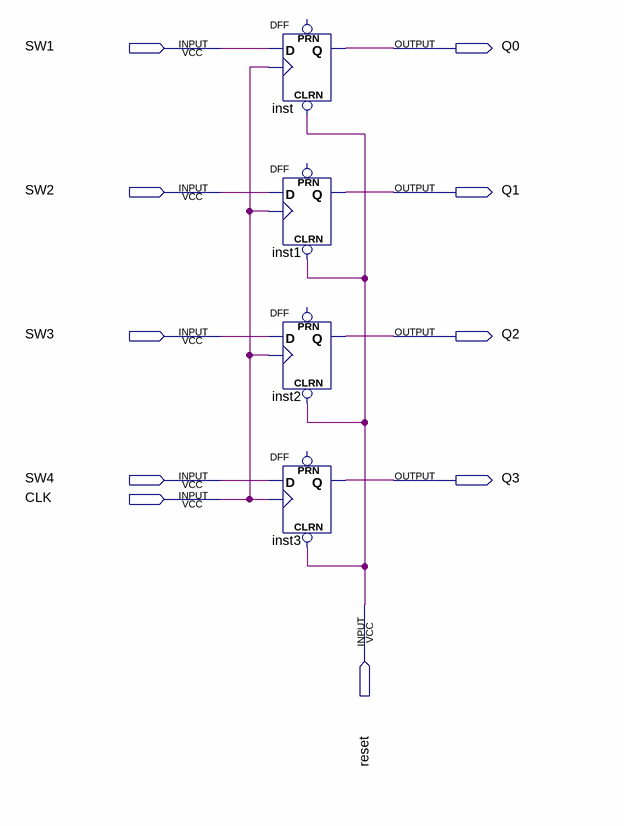
[diagram p0: schematic sheet]
// Quartus schematic dff4bit.bdf as structural Verilog: 4 symbols, 10 pins
module dff4bit (
  input  SW1,
  input  SW2,
  input  SW3,
  input  SW4,
  input  CLK,
  input  reset,
  output Q0,
  output Q1,
  output Q2,
  output Q3
);

  DFF inst (.CLRN(reset), .CLK(CLK), .D(SW1), .Q(Q0));  // open: PRN
  DFF inst1 (.CLRN(reset), .CLK(CLK), .D(SW2), .Q(Q1));  // open: PRN
  DFF inst2 (.CLRN(reset), .CLK(CLK), .D(SW3), .Q(Q2));  // open: PRN
  DFF inst3 (.CLRN(reset), .CLK(CLK), .D(SW4), .Q(Q3));  // open: PRN
endmodule
